# EAGLE design User Input Panel (EAGLE 7.2.0)
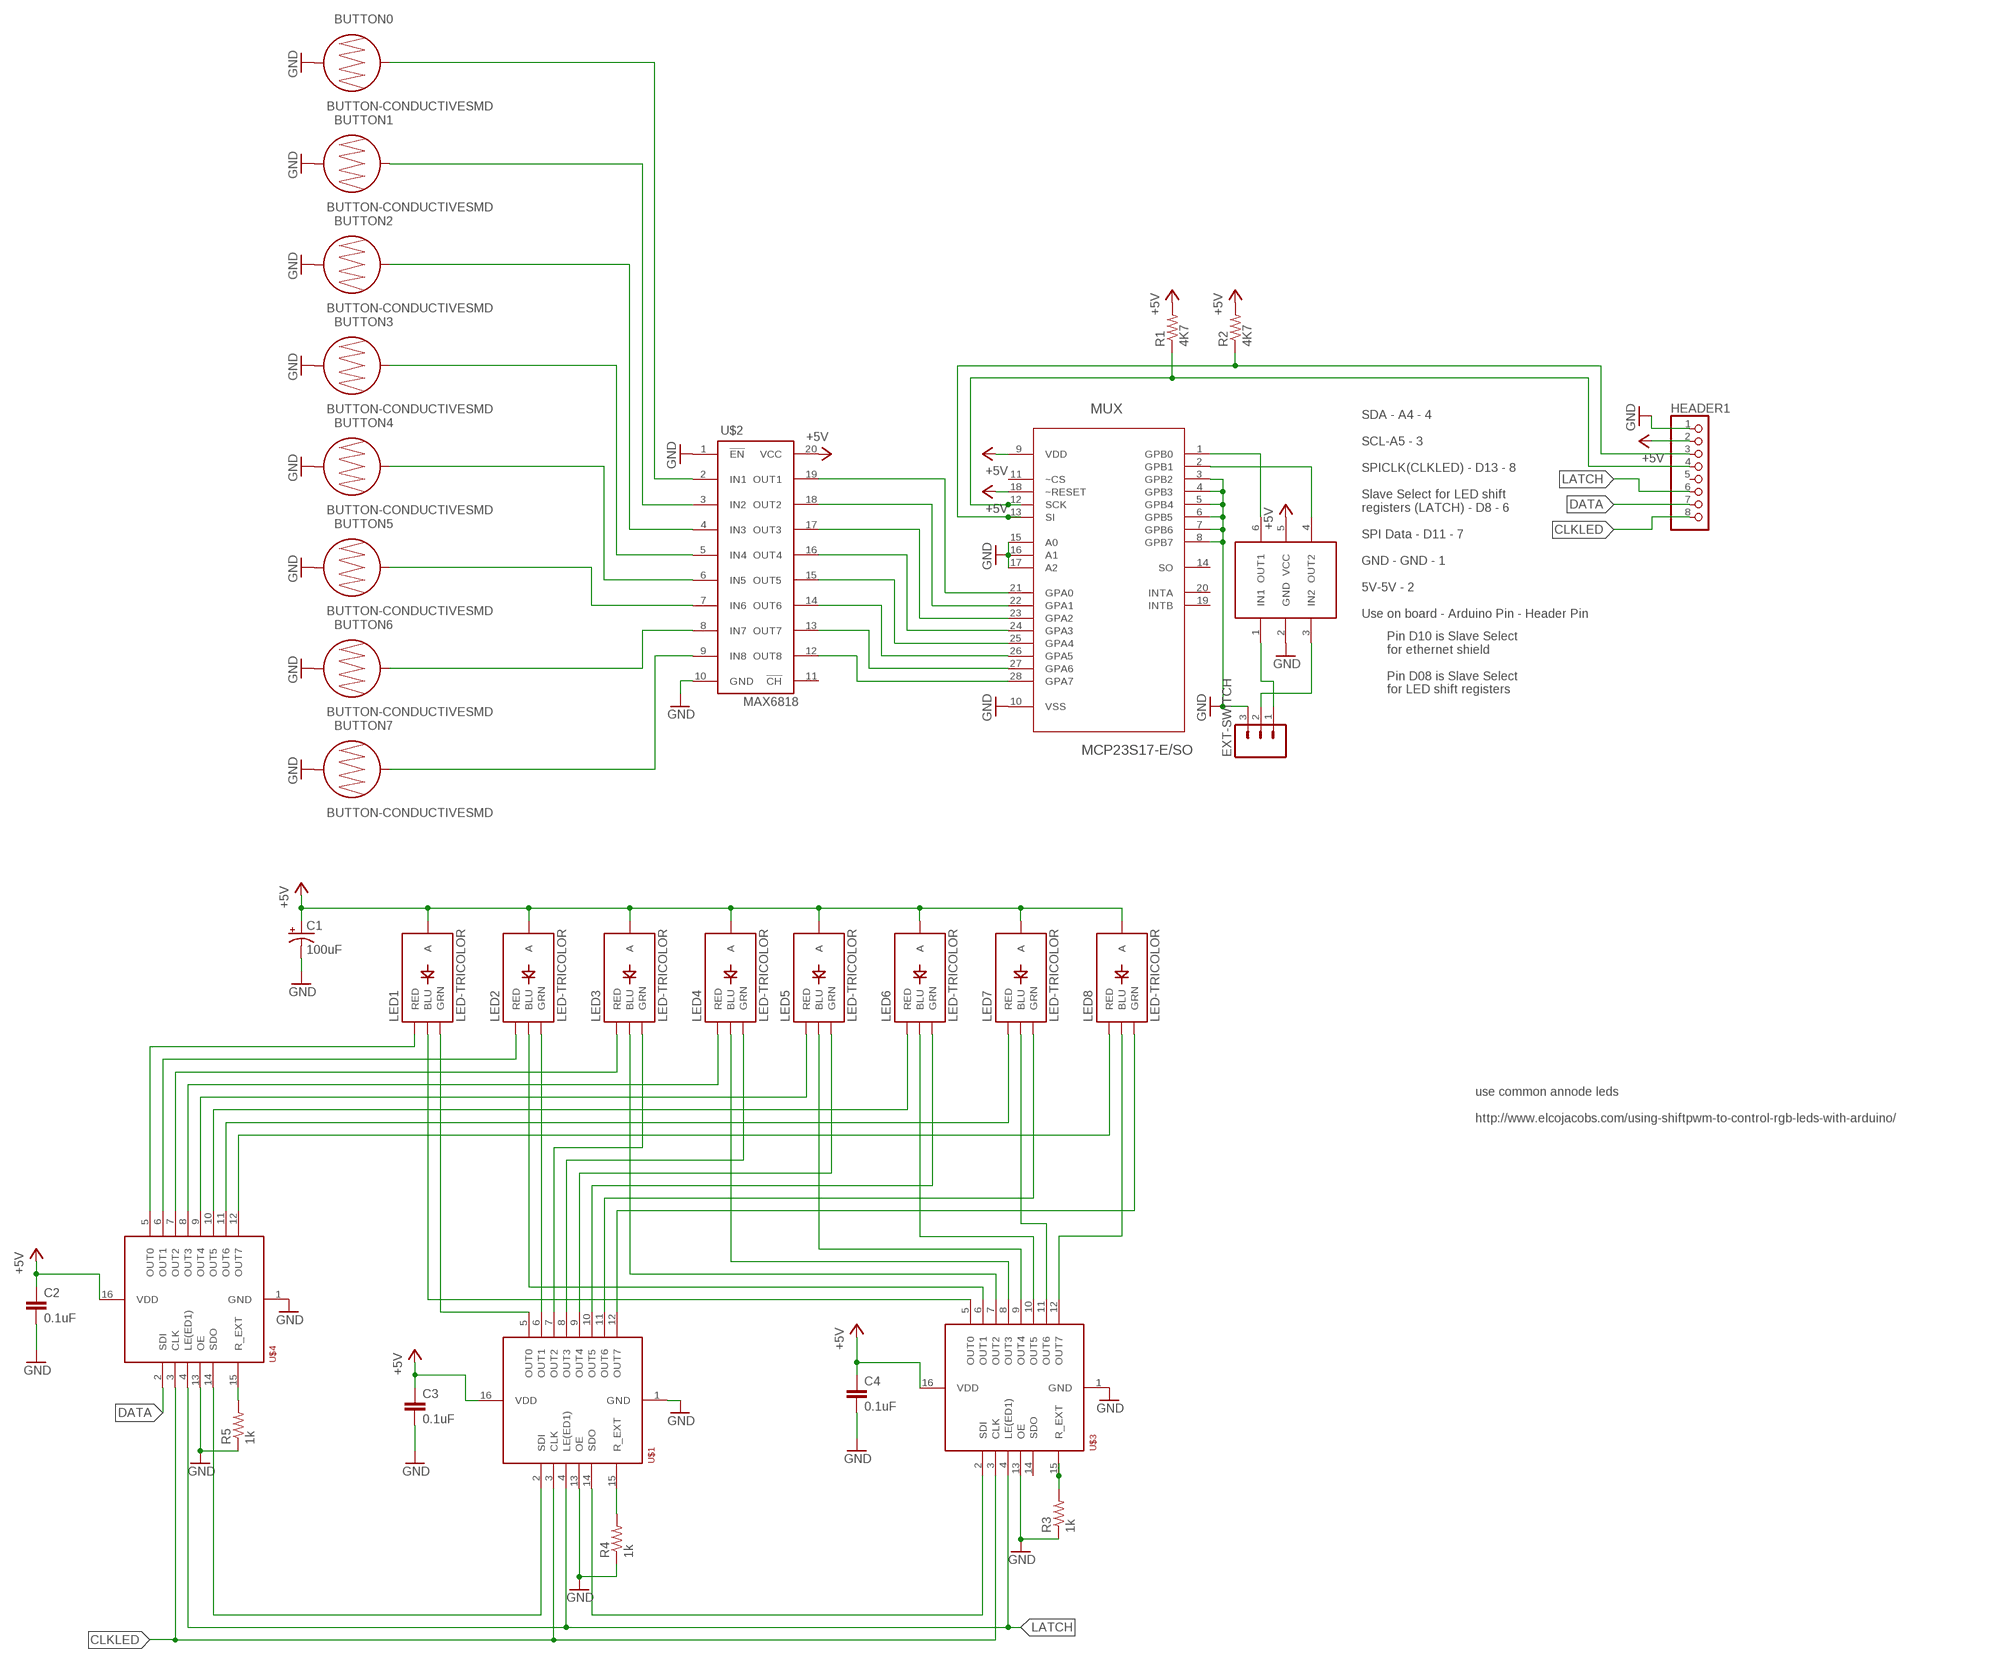
[diagram p0: schematic, sheet 1]

## Parts
BUTTON0  BUTTON-CONDUCTIVESMD  [BUTTON-CONDUCTIVE]
BUTTON1  BUTTON-CONDUCTIVESMD  [BUTTON-CONDUCTIVE]
BUTTON2  BUTTON-CONDUCTIVESMD  [BUTTON-CONDUCTIVE]
BUTTON3  BUTTON-CONDUCTIVESMD  [BUTTON-CONDUCTIVE]
BUTTON4  BUTTON-CONDUCTIVESMD  [BUTTON-CONDUCTIVE]
BUTTON5  BUTTON-CONDUCTIVESMD  [BUTTON-CONDUCTIVE]
BUTTON6  BUTTON-CONDUCTIVESMD  [BUTTON-CONDUCTIVE]
BUTTON7  BUTTON-CONDUCTIVESMD  [BUTTON-CONDUCTIVE]
C1  100uF  CAP_POL1206  [EIA3216]
C2  0.1uF  0.1UF-16V(+-10%)(0402)  [0402-CAP]
C3  0.1uF  0.1UF-16V(+-10%)(0402)  [0402-CAP]
C4  0.1uF  0.1UF-16V(+-10%)(0402)  [0402-CAP]
EXT-SWITCH  M03-SCREW-5MM  [SCREWTERMINAL-5MM-3]
HEADER1  PINHD-1X8BIG  [1X08-BIG]
LED1  LED-TRICOLOR  [LED-TRICOLOR-SMD]
LED2  LED-TRICOLOR  [LED-TRICOLOR-SMD]
LED3  LED-TRICOLOR  [LED-TRICOLOR-SMD]
LED4  LED-TRICOLOR  [LED-TRICOLOR-SMD]
LED5  LED-TRICOLOR  [LED-TRICOLOR-SMD]
LED6  LED-TRICOLOR  [LED-TRICOLOR-SMD]
LED7  LED-TRICOLOR  [LED-TRICOLOR-SMD]
LED8  LED-TRICOLOR  [LED-TRICOLOR-SMD]
MUX  MCP23S17-E/SO  [SOIC127P030X265-28N]
R1  4K7  R-US_0204/2V  [0204V]
R2  4K7  R-US_0204/2V  [0204V]
R3  1k  RESISTOR0402  [0402-RES]
R4  1k  RESISTOR0402  [0402-RES]
R5  1k  RESISTOR0402  [0402-RES]
U$1  TLC5916/17  [SOIC-16]
U$2  MAX6818  [SSOP20]
U$3  TLC5916/17  [SOIC-16]
U$4  TLC5916/17  [SOIC-16]
U$5  MAX6817  [SOT23-6L]

## Nets
+5V: C1.A(+) C2.1 C3.1 C4.1 HEADER1.2 LED1.A LED2.A LED3.A LED4.A LED5.A LED6.A LED7.A LED8.A U$1.16(VDD) U$2.20(VCC) U$3.16(VDD) U$4.16(VDD) U$5.5(VCC)
CLKLED: HEADER1.8 U$1.3(CLK) U$3.3(CLK) U$4.3(CLK)
DATA: HEADER1.7 U$4.2(SDI)
GND: BUTTON0.1 BUTTON1.1 BUTTON2.1 BUTTON3.1 BUTTON4.1 BUTTON5.1 BUTTON6.1 BUTTON7.1 C1.C(-) C2.2 C3.2 C4.2 EXT-SWITCH.3 HEADER1.1 MUX.3(GPB2) MUX.4(GPB3) MUX.5(GPB4) MUX.6(GPB5) MUX.7(GPB6) MUX.8(GPB7) MUX.10(VSS) MUX.15(A0) MUX.16(A1) MUX.17(A2) R3.1 R4.1 R5.1 U$1.1(GND) U$1.13(OE) U$2.1(!EN!) U$2.10(GND) U$3.1(GND) U$3.13(OE) U$4.1(GND) U$4.13(OE) U$5.2(GND)
LATCH: HEADER1.6 U$1.4(LE(ED1)) U$3.4(LE(ED1)) U$4.4(LE(ED1))
N$1: MUX.28(GPA7) U$2.12(OUT8)
N$2: MUX.24(GPA3) U$2.16(OUT4)
N$3: MUX.26(GPA5) U$2.14(OUT6)
N$4: MUX.25(GPA4) U$2.15(OUT5)
N$5: MUX.27(GPA6) U$2.13(OUT7)
N$6: MUX.23(GPA2) U$2.17(OUT3)
N$7: MUX.22(GPA1) U$2.18(OUT2)
N$8: MUX.21(GPA0) U$2.19(OUT1)
N$9: HEADER1.4 MUX.12(SCK) R1.1
N$10: HEADER1.3 MUX.13(SI) R2.1
N$13: U$1.2(SDI) U$4.14(SDO)
N$14: U$1.14(SDO) U$3.2(SDI)
N$15: MUX.1(GPB0) U$5.6(OUT1)
N$16: R5.2 U$4.15(R_EXT)
N$17: LED5.R(RED) U$4.9(OUT4)
N$18: LED6.R(RED) U$4.10(OUT5)
N$19: LED7.R(RED) U$4.11(OUT6)
N$20: R4.2 U$1.15(R_EXT)
N$21: R3.2 U$3.15(R_EXT)
N$22: LED1.R(RED) U$4.5(OUT0)
N$23: LED2.R(RED) U$4.6(OUT1)
N$24: LED3.R(RED) U$4.7(OUT2)
N$25: LED4.R(RED) U$4.8(OUT3)
N$26: LED8.R(RED) U$4.12(OUT7)
N$27: LED1.G(GRN) U$1.5(OUT0)
N$28: LED2.G(GRN) U$1.6(OUT1)
N$29: LED3.G(GRN) U$1.7(OUT2)
N$30: LED4.G(GRN) U$1.8(OUT3)
N$31: LED5.G(GRN) U$1.9(OUT4)
N$32: LED6.G(GRN) U$1.10(OUT5)
N$33: LED7.G(GRN) U$1.11(OUT6)
N$34: LED8.G(GRN) U$1.12(OUT7)
N$35: LED2.B(BLU) U$3.6(OUT1)
N$36: LED1.B(BLU) U$3.5(OUT0)
N$37: LED3.B(BLU) U$3.7(OUT2)
N$38: LED4.B(BLU) U$3.8(OUT3)
N$39: LED5.B(BLU) U$3.9(OUT4)
N$40: LED6.B(BLU) U$3.10(OUT5)
N$41: LED7.B(BLU) U$3.11(OUT6)
N$42: LED8.B(BLU) U$3.12(OUT7)
N$45: MUX.2(GPB1) U$5.4(OUT2)
N$46: BUTTON0.2 U$2.2(IN1)
N$47: BUTTON1.2 U$2.3(IN2)
N$48: BUTTON2.2 U$2.4(IN3)
N$49: BUTTON3.2 U$2.5(IN4)
N$52: BUTTON4.2 U$2.6(IN5)
N$53: BUTTON5.2 U$2.7(IN6)
N$54: BUTTON7.2 U$2.9(IN8)
N$55: BUTTON6.2 U$2.8(IN7)
N$56: EXT-SWITCH.1 U$5.1(IN1)
N$57: EXT-SWITCH.2 U$5.3(IN2)
VCC: MUX.9(VDD) MUX.18(~RESET) R1.2 R2.2 ; supply symbol labelled +5V
Unconnected: HEADER1.5 MUX.11(~CS) MUX.14(SO) MUX.19(INTB) MUX.20(INTA) U$2.11(!CH!) U$3.14(SDO)

## Notes on the sheet
- SDA - A4 - 4
  
  SCL-A5 - 3
  
  SPICLK(CLKLED) - D13 - 8
  
  Slave Select for LED shift
  registers (LATCH) - D8 - 6
  
  SPI Data - D11 - 7
  
  GND - GND - 1
  
  5V-5V - 2
  
  Use on board - Arduino Pin - Header Pin
- Pin D10 is Slave Select
  for ethernet shield
  
  Pin D08 is Slave Select
  for LED shift registers
- use common annode leds
  
  http://www.elcojacobs.com/using-shiftpwm-to-control-rgb-leds-with-arduino/

## Library data of the parts
BUTTON0 BUTTON1-BUTTON7 = SparkFun-Electromechanical:BUTTON-CONDUCTIVE: Used with rubber key pads. This one was designed and proven to work with the PolyCase Key FOB enclosures.
C1 = SparkFun-Capacitors:CAP_POL: Capacitor Polarized These are standard SMD and PTH capacitors. Normally 10uF, 47uF, and 100uF in electrolytic and tantalum varieties. Always verify the external diameter of the through hole cap, it varies with capacity, voltage, and manufacturer. The EIA devices should be standard.
C2-C4 = SparkFun-Capacitors:0.1UF-16V(+-10%)(0402); PROD_ID: CAP-12416
EXT-SWITCH = SparkFun-Connectors:M03: Header 3 Standard 3-pin 0.1" header. Use with straight break away headers (SKU : PRT-00116), right angle break away headers (PRT-00553), swiss pins (PRT-00743), machine pins (PRT-00117), and female headers (PRT-00115). Molex polarized connector foot print use with SKU : PRT-08232 with associated crimp pins and housings.; STOREFRONT_ID: PRT-08433
HEADER1 = adafruit:PINHD-1X8: PIN HEADER
LED1-LED8 = SparkFun-LED:LED-TRICOLOR: Tri-Color LED SMD Proven layout and schematic for triple color LED in SMD package - common anode. Spark Fun Electronics SKU : COM-07844
MUX = Microchip_By_element14_Batch_1:MCP23S17-E/SO: 16-Bit I/O Expander; DESCRIPTION: IC I/O EXPANDER; MPN: MCP23S17-E/SO; OC_FARNELL: 1332093; OC_NEWARK: 31K2950; PACKAGE: SOIC-28; SUPPLIER: Microchip
R1 R2 = resistor:R-US_: RESISTOR, American symbol
R3-R5 = SparkFun-Resistors:RESISTOR: Resistor Basic schematic elements and footprints for 0603, 1206, and PTH resistors.
U$1 U$3 U$4 = BillPorter:TLC5916/17: TLC5916/17 8-Channel Constant-Current LED Sink Driver and Shift Register in one. Great for driving high current LEDs that would kill a 595 shift register. Specs @ http://focus.ti.com/docs/prod/folders/print/tlc5916.html
U$2 = MAX68xx Hardware Debouncer:MAX6818
U$5 = MAX68xx Hardware Debouncer:MAX6817

## Board
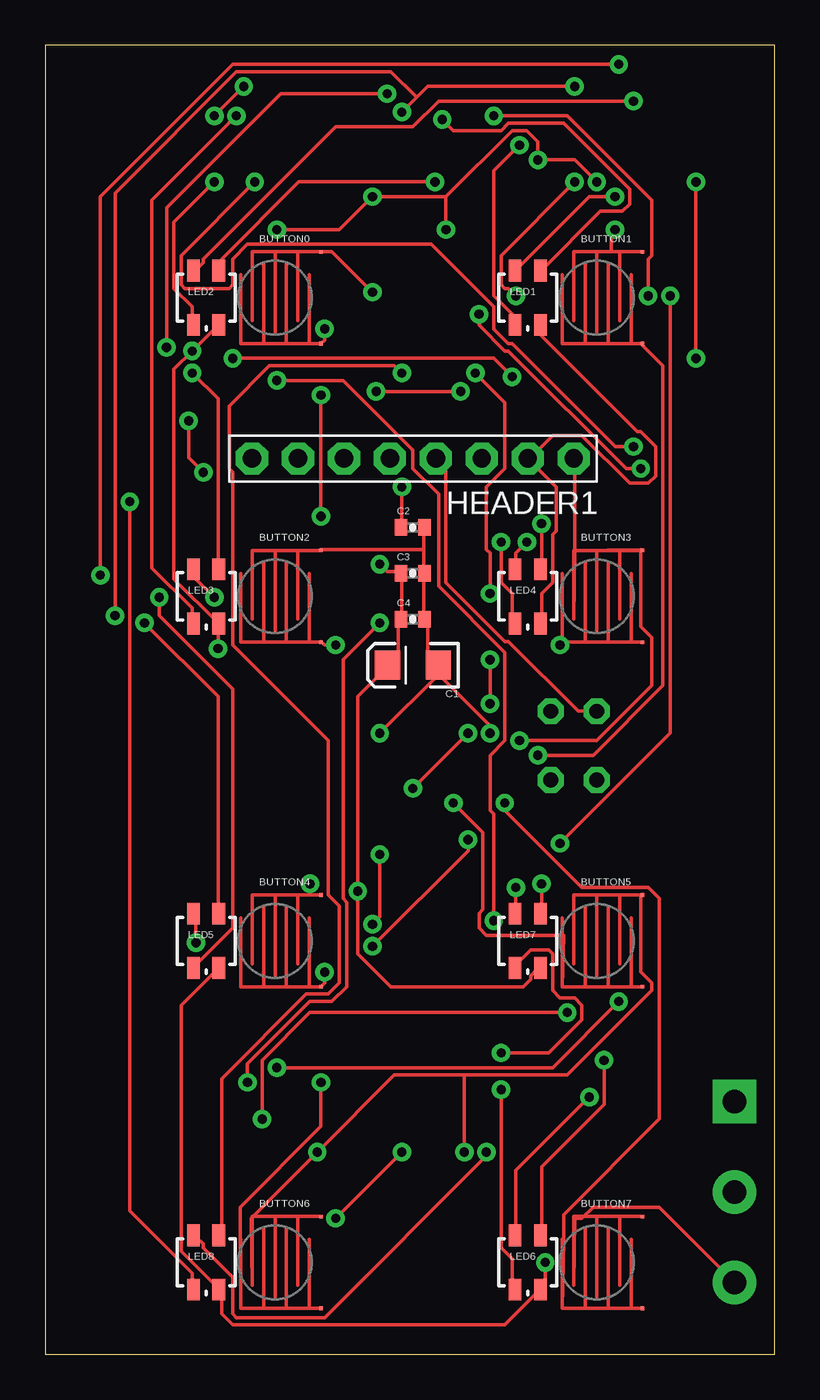
[diagram p1: board, top side]
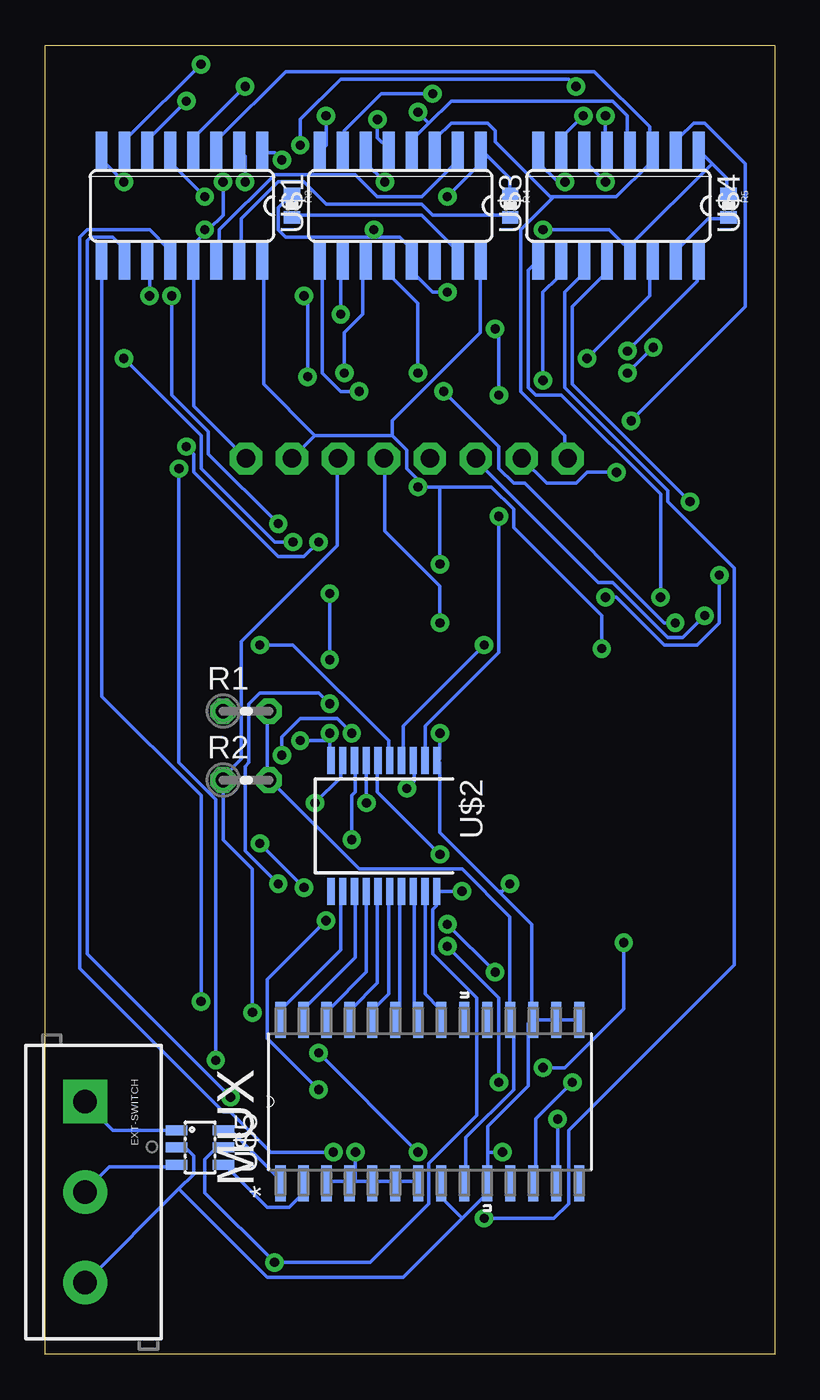
[diagram p2: board, bottom side, seen from below]

Size 40.31 x 72.38 mm. Coordinates in mm from the lower left corner, seen from the top.
Outline: 0,0 40.31,0 40.31,72.38 0,72.38 0,0
Copper layers (1*16): Top 0.035mm / dielectric 1.5mm / Bottom 0.035mm
Design rules "SparkFun": minimum track width 8mil, minimum drill 20mil, track to track 8mil, track to pad 8mil, pad to pad 8mil, via to via 8mil, smd to smd 8mil, copper to edge 10mil, drill to drill 8mil, minimum pad ring 12mil, minimum via ring 10mil, stop-mask expansion 4mil, vias tented up to drill 25mil, thermal gap 10mil

### Footprints (pad centres in the part's own frame; a part is rotated, then mirrored left to right if it is on the bottom)
BUTTON-CONDUCTIVE = smd 0.203 x 0.203: 1 2.54,2.54; 2 2.54,-2.54
EIA3216 = smd 1.4 x 1.6: A 1.4,0; C -1.4,0
0402-CAP = smd 0.7 x 0.9: 1 -0.65,0; 2 0.65,0
SCREWTERMINAL-5MM-3 = drill 1.3 pad 2.413 square: 1 0,0 | drill 1.3 pad 2.413: 2 5,0; 3 10,0
1X08-BIG = drill 1.016 pad 1.778 octagon: 1 -8.89,0; 2 -6.35,0; 3 -3.81,0; 4 -1.27,0; 5 1.27,0; 6 3.81,0; 7 6.35,0; 8 8.89,0
LED-TRICOLOR-SMD = smd 0.7 x 1.2: A 0.7,-1.5; B 0.7,1.5; G -0.7,1.5; R -0.7,-1.5
SOIC127P030X265-28N = smd 1.981 x 0.559: 1 -4.521,8.255; 2 -4.521,6.985; 3 -4.521,5.715; 4 -4.521,4.445; 5 -4.521,3.175; 6 -4.521,1.905; 7 -4.521,0.635; 8 -4.521,-0.635; 9 -4.521,-1.905; 10 -4.521,-3.175; 11 -4.521,-4.445; 12 -4.521,-5.715; 13 -4.521,-6.985; 14 -4.521,-8.255; 15 4.521,-8.255; 16 4.521,-6.985; 17 4.521,-5.715; 18 4.521,-4.445; 19 4.521,-3.175; 20 4.521,-1.905; 21 4.521,-0.635; 22 4.521,0.635; 23 4.521,1.905; 24 4.521,3.175; 25 4.521,4.445; 26 4.521,5.715; 27 4.521,6.985; 28 4.521,8.255
0204V = drill 0.813 octagon: 1 -1.27,0; 2 1.27,0
0402-RES = smd 0.7 x 0.9: 1 -0.65,0; 2 0.65,0
SOIC-16 = smd 0.66 x 2.032: 1 -4.075,-3.073; 2 -2.805,-3.073; 3 -1.535,-3.073; 4 -0.265,-3.073; 5 1.005,-3.073; 6 2.275,-3.073; 7 3.545,-3.073; 8 4.815,-3.073; 9 4.815,3.073; 10 3.545,3.073; 11 2.275,3.073; 12 1.005,3.073; 13 -0.265,3.073; 14 -1.535,3.073; 15 -2.805,3.073; 16 -4.075,3.073
SSOP20 = smd 0.4 x 1.5: 1 -2.925,-3.625; 2 -2.275,-3.625; 3 -1.625,-3.625; 4 -0.975,-3.625; 5 -0.325,-3.625; 6 0.325,-3.625; 7 0.975,-3.625; 8 1.625,-3.625; 9 2.275,-3.625; 10 2.925,-3.625; 11 2.925,3.625; 12 2.275,3.625; 13 1.625,3.625; 14 0.975,3.625; 15 0.325,3.625; 16 -0.325,3.625; 17 -0.975,3.625; 18 -1.625,3.625; 19 -2.275,3.625; 20 -2.925,3.625
SOT23-6L = smd 0.55 x 1.2: 1 -0.95,-1.3; 2 0,-1.3; 3 0.95,-1.3; 4 0.95,1.3; 5 0,1.3; 6 -0.95,1.3

### Placement (x,y rotation side)
BUTTON0  12.7,58.42 0 top
BUTTON1  30.48,58.42 0 top
BUTTON2  12.7,41.91 0 top
BUTTON3  30.48,41.91 0 top
BUTTON4  12.7,22.86 0 top
BUTTON5  30.48,22.86 0 top
BUTTON6  12.7,5.08 0 top
BUTTON7  30.48,5.08 0 top
C1  20.32,38.1 180 top
C2  20.32,45.72 0 top
C3  20.32,43.18 0 top
C4  20.32,40.64 0 top
EXT-SWITCH  38.1,13.97 270 bottom
HEADER1  20.32,49.53 180 top
LED1  26.67,58.42 0 top
LED2  8.89,58.42 0 top
LED3  8.89,41.91 0 top
LED4  26.67,41.91 0 top
LED5  8.89,22.86 0 top
LED6  26.67,5.08 0 top
LED7  26.67,22.86 0 top
LED8  8.89,5.08 0 top
MUX  19.05,13.97 90 bottom
R1  29.21,35.56 0 bottom
R2  29.21,31.75 0 bottom
R3  26.67,63.5 270 bottom
R4  14.61,63.5 270 bottom
R5  2.54,63.5 270 bottom
U$1  32.38,63.5 180 bottom
U$2  21.59,29.21 180 bottom
U$3  20.32,63.5 180 bottom
U$4  8.26,63.5 180 bottom
U$5  31.75,11.43 270 bottom

### Tracks (layer width: path | path; a pad name or v marks a point on that pad's centre or on a via)
+5V  (via drill 0.51)
  Top 0.203: LED5.A 9.55,21.34 7.52,19.3 7.52,5.69 9.55,3.66 LED8.A 9.75,3.45 9.75,2.23 10.36,1.63 25.4,1.63 27.23,3.45 LED6.A 27.43,3.66 27.64,3.86 v27.64,5.08 | LED7.A 27.23,21.34 26.82,20.93 26.82,20.73 26.42,20.32 19.1,20.32 17.27,22.15 v17.27,25.6 17.27,36.37 18.9,38 C1.A 19.1,38.2 19.51,38.61 19.51,40.64 C4.1 19.71,40.64 19.71,43.08 C3.1 19.51,43.28 18.9,43.28 v18.49,43.69 | LED2.A 9.55,56.9 v8.13,55.47 7.11,54.46 7.11,42.88 9.55,40.44 LED3.A 9.55,40.23 v9.55,39.01 | v19.71,47.95 19.71,45.72 C2.1 | LED4.A 27.43,40.44 27.43,42.06 28.04,42.67 28.04,45.31 28.25,45.52 28.25,47.95 HEADER1.2 26.82,49.58 28.04,50.8 29.67,50.8 32.31,48.16 33.33,48.16 33.73,48.56 33.73,50.19 32.92,51 32.72,51 27.43,56.29 27.43,56.9 LED1.A
  Bottom 0.203: U$5.5 30.48,11.38 30.89,11.38 31.5,10.77 31.5,8.94 v27.64,5.08 22.35,5.08 19.1,8.33 19.1,10.57 16.46,13.21 16.46,19.71 18.9,22.15 18.9,24.59 18.69,24.79 18.69,25.4 U$2.20 18.49,25.6 v17.27,25.6 | v8.13,55.47 4.27,59.33 4.27,60.35 U$4.16 | 21.13,50.8 20.32,49.99 20.32,48.97 19.71,48.36 v19.71,47.95 18.49,47.95 | 25.4,50.8 21.13,50.8 | HEADER1.2 25.4,50.8 | 21.13,50.8 21.13,51.61 16.26,56.49 16.26,60.35 U$3.16 | 25.4,50.8 28.25,53.65 28.25,60.35 U$1.16 | v9.55,39.01 9.55,40.84 14.43,45.72 14.43,46.74 15.65,47.95 18.49,47.95 | 18.49,47.95 v18.49,43.69
CLKLED
  Bottom 0.203: 12.19,64.01 12.39,64.01 15.44,67.06 15.44,67.67 15.85,68.07 17.88,68.07 18.69,67.26 18.69,66.65 U$3.3 | 12.19,64.01 8.74,64.01 6.91,65.84 6.91,66.45 U$4.3 6.91,66.65 6.91,67.87 9.96,70.92 27.03,70.92 30.68,67.26 30.68,66.65 U$1.3 | 12.19,64.01 14.02,62.18 14.02,53.24 11.58,50.8 11.58,49.58 HEADER1.8
DATA  (via drill 0.51)
  Top 0.203: v7.92,51.61 7.92,49.58 v8.74,48.77
  Bottom 0.203: v7.92,51.61 1.63,57.91 1.63,65.84 3.86,68.07 4.47,68.07 5.28,67.26 5.28,66.65 U$4.2 | v8.74,48.77 10.36,48.77 10.97,48.16 12.6,48.16 HEADER1.7
GND  (via drill 0.51)
  Top 0.203: BUTTON0.1 15.85,60.96 v18.09,58.73 | v30.48,64.82 29.26,66.04 v27.23,66.04 27.23,67.06 26.62,67.67 25.81,67.67 22.15,64.01 | 29.21,40.64 29.26,44.5 29.26,49.38 HEADER1.1 | v31.5,62.18 31.29,61.98 31.29,60.96 29.21,60.96 | 22.15,64.01 v18.09,64.01 16.26,62.18 v12.8,62.18 | 22.15,64.01 v22.15,62.18 | 20.93,44.5 20.93,43.28 C3.2 20.93,43.08 20.93,40.64 C4.2 21.13,40.64 21.13,38.61 21.54,38.2 C1.C | 20.93,44.5 20.93,45.72 C2.2 | v24.59,34.34 24.59,34.75 21.74,37.59 | 21.74,37.59 21.74,38 C1.C | 20.93,44.5 15.24,44.5 BUTTON2.1 | 29.21,3.81 29.26,7.52 29.67,7.52 30.28,8.13 33.93,8.13 38,4.06 EXT-SWITCH.3 | 11.43,3.81 11.38,7.52 v15.04,11.18 19.3,15.44 23.16,15.44 | v14.63,26.01 14.63,25.4 11.43,25.4 | 23.16,15.44 28.85,15.44 33.53,20.12 33.53,20.52 32.92,21.13 32.92,25.4 29.21,25.4 | v18.49,34.34 21.74,37.59 | 21.74,37.59 C1.C | v26.21,33.93 30.48,33.93 33.53,36.98 33.53,39.62 32.92,40.23 32.92,44.5 29.21,44.45 | v23.16,11.18 23.16,15.44
  Bottom 0.203: 22.15,61.77 20.73,61.77 20.12,61.16 20.12,60.55 U$3.13 19.91,60.35 19.91,59.74 18.9,58.73 v18.09,58.73 | 22.15,61.77 27.03,61.77 27.43,62.18 27.43,63.4 26.82,64.01 R3.1 | 3.45,65.84 4.06,66.45 U$4.1 | 3.45,65.84 2.64,65.02 2.64,64.21 R5.1 | 7.92,61.37 7.92,60.55 U$4.13 7.92,61.37 | 3.45,65.84 7.92,61.37 | 15.85,66.24 16.05,66.45 U$3.1 | 15.85,66.24 14.63,65.02 14.63,64.21 R4.1 | HEADER1.1 32.11,52.43 32.11,60.35 U$1.13 32.11,60.55 32.11,61.37 31.29,62.18 | v27.23,66.04 27.64,66.45 28.25,66.45 U$1.1 | v30.48,64.82 30.48,62.99 31.29,62.18 | 31.29,62.18 v31.5,62.18 | v18.09,64.01 15.85,66.24 | 7.92,61.37 8.33,61.37 9.14,62.18 v12.8,62.18 | v22.15,62.18 22.15,61.77 | 24.59,33.93 24.59,32.92 U$2.10 | 32.92,9.14 38,4.06 EXT-SWITCH.3 | 32.92,9.14 32.11,9.96 32.11,10.97 32.51,11.38 32.92,11.38 U$5.2 | MUX.15 MUX.16 MUX.17 13.41,18.49 | 15.24,25.6 13.41,23.77 13.41,18.49 | 15.24,25.6 18.49,28.85 18.49,32.72 U$2.1 18.49,32.92 v18.49,34.34 | 15.85,11.18 15.85,12.6 13.61,14.83 13.61,18.29 13.41,18.49 | 15.85,11.18 15.85,9.55 MUX.10 16.05,9.35 16.05,8.74 17.27,7.52 | 15.85,11.18 v15.04,11.18 | v14.63,26.01 15.04,25.6 15.24,25.6 | 32.92,9.14 28.04,4.27 20.52,4.27 17.27,7.52 | 24.59,33.93 v26.21,33.93 | 24.59,33.93 v24.59,34.34 | MUX.7 19.71,9.55 20.93,9.55 MUX.6 21.13,9.55 22.15,9.55 MUX.5 22.35,9.55 23.16,9.55 | 17.27,7.52 18.29,8.53 18.29,9.35 MUX.8 | 23.16,9.55 23.37,9.55 MUX.4 23.57,9.55 24.59,9.55 MUX.3 | 23.16,9.55 v23.16,11.18
LATCH  (via drill 0.51)
  Top 0.203: v29.26,70.1 21.13,70.1 20.52,69.49 | v19.71,68.68 20.52,69.49 | v3.86,40.84 3.86,64.21 10.57,70.92 19.1,70.92 20.52,69.49
  Bottom 0.203: 19.1,68.07 19.91,67.26 19.91,66.65 U$3.4 | 19.1,68.07 17.88,69.29 8.94,69.29 8.13,68.48 8.13,66.65 U$4.4 | v29.26,70.1 32.11,67.26 32.11,66.65 U$1.4 | 19.1,68.07 v19.71,68.68 | v3.86,40.84 5.08,39.62 5.89,39.62 8.94,42.67 9.75,42.67 16.46,49.38 HEADER1.6
N$1
  Bottom 0.203: U$2.12 23.98,25.4 23.98,22.35 27.23,19.1 27.23,18.49 MUX.28
N$2
  Bottom 0.203: U$2.16 21.34,25.4 21.34,19.91 22.15,19.1 22.15,18.49 MUX.24
N$3
  Bottom 0.203: U$2.14 22.55,25.4 22.55,21.13 24.59,19.1 24.59,18.49 MUX.26
N$4
  Bottom 0.203: U$2.15 21.95,25.4 21.95,20.52 23.37,19.1 23.37,18.49 MUX.25
N$5
  Bottom 0.203: U$2.13 23.16,25.4 23.16,21.95 26.01,19.1 26.01,18.49 MUX.27
N$6
  Bottom 0.203: U$2.17 20.73,25.4 20.73,18.69 20.93,18.49 MUX.23
N$7
  Bottom 0.203: U$2.18 19.91,25.4 19.91,18.69 19.71,18.49 MUX.22
N$8
  Bottom 0.203: U$2.19 19.3,25.4 19.3,19.91 18.49,19.1 18.49,18.49 MUX.21
N$9  (via drill 0.51)
  Top 0.203: v11.18,15.04 11.18,16.05 14.63,19.51 15.85,19.51 16.66,20.32 16.66,24.99 16.46,25.2 16.46,38.41 v18.49,40.44 | R1.1 29.46,35.56 25.6,39.42 25.4,39.42 22.15,42.67 22.15,48.97 HEADER1.4
  Bottom 0.203: v11.18,15.04 13.21,13.01 13.21,9.55 MUX.12 | v18.49,40.44 18.49,42.47 21.54,45.52 21.54,49.38 HEADER1.4
N$10  (via drill 0.51)
  Top 0.203: v11.99,13.01 11.99,16.26 14.63,18.9 v28.85,18.9
  Bottom 0.203: v11.99,13.01 11.99,9.55 MUX.13 | v28.85,18.9 28.85,26.82 30.48,28.45 R2.1 30.48,31.9 29.46,32.92 29.46,39.42 24.18,44.7 24.18,49.38 HEADER1.3
N$13  (via drill 0.51)
  Top 0.203: v10.36,55.07 24.79,55.07 v25.81,54.05 | v26.01,58.52 25.6,58.93 25.4,58.93 25.2,59.13 25.2,60.76 v29.26,64.82
  Bottom 0.203: v10.36,55.07 6.91,58.52 6.91,60.35 U$4.14 | v25.81,54.05 25.81,58.32 v26.01,58.52 | v29.26,64.82 29.26,66.24 29.46,66.45 U$1.2
N$14
  Bottom 0.203: U$1.14 30.68,60.55 30.68,62.18 27.64,65.23 23.16,65.23 21.95,64.01 19.51,64.01 17.68,65.84 17.68,66.45 U$3.2
N$15
  Bottom 0.203: U$5.6 30.28,12.19 29.87,12.19 27.23,9.55 MUX.1
N$16
  Bottom 0.203: R5.2 2.64,62.79 3.66,62.79 5.28,61.16 5.28,60.55 U$4.15
N$17  (via drill 0.51)
  Top 0.203: v6.3,41.86 6.3,40.84 10.36,36.78 10.36,23.57 8.33,21.54 LED5.R
  Bottom 0.203: v6.3,41.86 6.3,47.55 11.79,53.03 13.21,53.03 13.61,53.44 13.61,59.94 13.21,60.35 U$4.9
N$18  (via drill 0.51)
  Top 0.203: v25.2,14.63 25.2,5.89 25.81,5.28 25.81,3.66 LED6.R | v24.79,23.98 24.79,29.87 24.59,30.07 24.59,33.12 25.4,33.93 25.4,38.81 21.74,42.47 21.74,47.55 20.32,48.97 20.32,49.99 16.46,53.85 v12.8,53.85
  Bottom 0.203: v25.2,14.63 28.04,17.48 28.04,20.73 v24.79,23.98 | v12.8,53.85 12.8,58.73 11.99,59.54 11.99,60.35 U$4.10
N$19  (via drill 0.51)
  Top 0.203: v25.2,16.66 27.84,16.66 29.67,18.49 29.67,19.3 29.26,19.71 28.45,19.71 28.04,20.12 28.04,22.15 27.84,22.35 26.82,22.35 26.01,21.54 LED7.R | v16.05,7.52 v19.71,11.18
  Bottom 0.203: v19.71,11.18 v25.2,16.66 | v16.05,7.52 12.19,7.52 11.38,8.33 11.38,12.39 2.23,21.54 2.23,43.48 5.89,47.14 5.89,47.75 11.58,53.44 11.58,58.73 10.57,59.74 10.57,60.35 U$4.11
N$20
  Bottom 0.203: R4.2 14.63,62.99 18.9,62.99 19.51,63.6 24.79,63.6 26.01,64.82 27.43,64.82 29.46,62.79 29.46,60.55 U$1.15
N$21
  Bottom 0.203: R3.2 26.62,62.99 19.51,62.99 17.68,61.16 17.68,60.55 U$3.15
N$22  (via drill 0.51)
  Top 0.203: v26.21,66.85 24.79,65.43 24.79,58.52 25.81,57.51 25.81,57.1 LED1.R | v9.35,68.48 v10.97,70.1
  Bottom 0.203: v26.21,66.85 26.21,68.28 23.98,70.51 11.38,70.51 v10.97,70.1 | v9.35,68.48 9.35,66.65 U$4.5
N$23  (via drill 0.51)
  Top 0.203: v9.35,64.82 7.11,62.59 7.11,58.93 8.13,57.91 8.13,57.1 LED2.R
  Bottom 0.203: v9.35,64.82 10.36,65.84 10.36,66.45 U$4.6
N$24  (via drill 0.51)
  Top 0.203: v10.57,68.48 5.89,63.8 5.89,43.48 8.13,41.25 8.13,40.44 LED3.R
  Bottom 0.203: v10.57,68.48 11.79,67.26 11.79,66.65 U$4.7
N$25  (via drill 0.51)
  Top 0.203: v25.2,44.91 25.2,42.67 25.81,42.06 25.81,40.44 LED4.R | v32.51,50.19 31.5,50.19 25.81,55.88 25.6,55.88 24.79,56.69 24.79,57.91 21.34,61.37 11.18,61.37 10.36,60.55 10.36,59.13 10.16,58.93 7.72,58.93 7.52,59.13 7.52,60.76 v11.58,64.82
  Bottom 0.203: v25.2,44.91 26.01,44.09 27.43,44.09 32.11,48.77 32.11,49.78 v32.51,50.19 | v11.58,64.82 11.99,64.82 13.01,65.84 13.01,66.45 U$4.8
N$26  (via drill 0.51)
  Top 0.203: v4.67,47.14 4.67,7.92 8.13,4.47 8.13,3.66 LED8.R
  Bottom 0.203: v4.67,47.14 11.18,53.65 11.18,57.91 9.35,59.74 9.35,60.35 U$4.12
N$27  (via drill 0.51)
  Top 0.203: v31.5,64.01 30.07,64.01 26.01,59.94 LED1.G
  Bottom 0.203: v31.5,64.01 33.33,65.84 33.33,66.45 U$1.5
N$28  (via drill 0.51)
  Top 0.203: v32.51,69.29 21.74,69.29 20.32,67.87 16.05,67.87 8.74,60.55 8.74,60.35 8.33,59.94 LED2.G
  Bottom 0.203: v32.51,69.29 34.54,67.26 34.54,66.65 U$1.6
N$29  (via drill 0.51)
  Top 0.203: v9.35,41.86 8.33,42.88 8.33,43.28 LED3.G | v3.05,43.08 3.05,64.01 10.36,71.32 v31.7,71.32
  Bottom 0.203: v9.35,41.86 8.74,41.86 6.1,39.22 4.27,39.22 3.05,40.44 v3.05,43.08 | v31.7,71.32 35.76,67.26 35.76,66.65 U$1.7
N$30  (via drill 0.51)
  Top 0.203: v26.62,44.91 26.01,44.3 26.01,43.48 LED4.G | v35.97,64.82 v35.97,55.07
  Bottom 0.203: v26.62,44.91 27.64,44.91 31.7,48.97 31.7,50.8 v35.97,55.07 | v35.97,64.82 37.19,66.04 37.19,66.45 U$1.8
N$31  (via drill 0.51)
  Top 0.203: v8.33,22.76 8.33,24.18 LED5.G | v12.8,15.85 28.04,15.85 v31.7,19.51
  Bottom 0.203: v8.33,22.76 8.33,19.1 11.58,15.85 v12.8,15.85 | v31.7,19.51 31.7,30.89 37.19,36.37 37.19,60.35 U$1.9
N$32  (via drill 0.51)
  Top 0.203: v30.07,14.22 26.01,10.16 26.01,6.71 LED6.G
  Bottom 0.203: v30.07,14.22 38,22.15 38,61.57 37.8,61.77 36.58,61.77 35.97,61.16 35.97,60.55 U$1.10
N$33  (via drill 0.51)
  Top 0.203: v26.01,25.81 26.01,24.38 LED7.G | v28.45,28.25 34.54,34.34 v34.54,58.52
  Bottom 0.203: v28.45,28.25 v26.01,25.81 | v34.54,58.52 34.54,60.35 U$1.11
N$34  (via drill 0.51)
  Top 0.203: v24.38,11.18 24.38,10.97 15.44,2.03 10.57,2.03 10.36,2.23 10.36,4.27 8.74,5.89 8.74,6.1 8.33,6.5 LED8.G
  Bottom 0.203: v24.38,11.18 27.84,11.18 30.07,13.41 30.48,13.41 38.41,21.34 38.41,61.77 38,62.18 34.54,62.18 33.53,61.16 33.53,60.55 U$1.12
N$35  (via drill 0.51)
  Top 0.203: v21.54,64.82 14.02,64.82 9.75,60.55 9.75,59.94 LED2.B
  Bottom 0.203: v21.54,64.82 22.55,65.84 22.55,66.45 U$3.6
N$36  (via drill 0.51)
  Top 0.203: v21.95,68.28 22.55,67.67 25.2,67.67 25.6,68.07 28.65,68.07 32.31,64.41 32.31,63.6 31.9,63.2 30.68,63.2 27.43,59.94 LED1.B
  Bottom 0.203: v21.95,68.28 21.95,67.26 21.34,66.65 U$3.5
N$37  (via drill 0.51)
  Top 0.203: v8.13,54.25 9.55,52.83 9.55,43.48 LED3.B | v6.71,55.68 6.71,63.4 13.01,69.7 v18.9,69.7
  Bottom 0.203: v6.71,55.68 v8.13,54.25 | v18.9,69.7 21.74,69.7 23.77,67.67 23.77,66.65 U$3.7
N$38  (via drill 0.51)
  Top 0.203: v27.43,45.92 27.43,43.48 LED4.B | v33.33,58.52 33.33,60.55 33.53,60.76 33.53,63.8 28.85,68.48 v24.79,68.48
  Bottom 0.203: v27.43,45.92 31.29,49.78 31.29,51 33.33,53.03 v33.33,58.52 | v24.79,68.48 24.79,66.85 24.99,66.65 U$3.8
N$39  (via drill 0.51)
  Top 0.203: v5.49,40.44 9.55,36.37 9.55,24.38 LED5.B | v22.96,53.24 v18.29,53.24
  Bottom 0.203: v5.49,40.44 6.1,40.44 13.82,48.16 14.43,48.16 15.24,48.97 15.24,50.19 v18.29,53.24 | v22.96,53.24 23.98,53.24 24.99,54.25 24.99,60.35 U$3.9
N$40  (via drill 0.51)
  Top 0.203: v30.89,16.26 30.89,13.82 27.43,10.36 27.43,6.71 LED6.B | v32.92,48.97 32.11,48.97 25.6,55.47 25.4,55.47 23.98,56.9 v23.98,57.51
  Bottom 0.203: v30.89,16.26 30.89,30.68 32.92,32.72 v32.92,48.97 | v23.98,57.51 23.98,60.35 U$3.10
N$41  (via drill 0.51)
  Top 0.203: v27.43,26.01 27.43,24.38 LED7.B | v24.59,38.41 v24.59,35.97 | v24.59,42.06 24.59,44.3 24.38,44.5 24.38,47.95 25.4,48.97 25.4,52.63 v23.77,54.25
  Bottom 0.203: v27.43,26.01 29.26,27.84 29.26,32.51 29.06,32.72 29.06,35.97 28.45,36.58 25.2,36.58 v24.59,35.97 | v24.59,42.06 v24.59,38.41 | v23.77,54.25 23.77,56.49 22.76,57.51 22.76,60.35 U$3.11
N$42  (via drill 0.51)
  Top 0.203: v19.71,54.25 19.3,54.66 12.39,54.66 10.16,52.43 10.16,48.97 10.36,48.77 10.36,39.22 15.65,33.93 15.65,25.4 16.26,24.79 16.26,20.52 15.65,19.91 14.43,19.91 9.75,15.24 9.75,6.71 LED8.B
  Bottom 0.203: v19.71,54.25 19.71,58.12 21.13,59.54 21.13,60.35 U$3.12
N$45
  Bottom 0.203: U$5.4 30.28,10.36 28.04,8.13 26.82,8.13 26.21,8.74 26.21,9.35 MUX.2
N$46  (via drill 0.51)
  Top 0.203: v15.24,53.03 v15.24,46.33 | v15.44,56.69 15.44,56.08 BUTTON0.2
  Bottom 0.203: v15.24,46.33 15.24,38.81 19.3,34.75 19.3,32.92 U$2.2 | v15.24,53.03 15.24,56.49 v15.44,56.69
N$47  (via drill 0.51)
  Top 0.203: v23.37,34.34 v20.32,31.29 | v27.23,33.12 30.28,33.12 34.14,36.98 34.14,54.66 32.92,55.88 28.57,55.88
  Bottom 0.203: v20.32,31.29 19.91,31.7 19.91,32.72 U$2.3 | v23.37,34.34 24.18,35.15 26.21,35.15 27.23,34.14 v27.23,33.12
N$48  (via drill 0.51)
  Top 0.203: v16.05,39.22 15.44,39.22 15.24,39.42 BUTTON2.2
  Bottom 0.203: v16.05,39.22 20.52,34.75 20.52,32.92 U$2.4
N$49  (via drill 0.51)
  Top 0.203: v28.45,39.22 28.65,39.42 28.57,39.37
  Bottom 0.203: v28.45,39.22 26.62,39.22 21.34,33.93 21.34,32.92 U$2.5
N$52  (via drill 0.51)
  Top 0.203: v18.49,27.64 18.49,24.18 v18.09,23.77 | v15.44,21.13 15.44,20.52 BUTTON4.2
  Bottom 0.203: v18.49,27.64 21.95,31.09 21.95,32.72 U$2.6 | v15.44,21.13 v18.09,23.77
N$53  (via drill 0.51)
  Top 0.203: v22.55,30.48 24.18,28.85 24.18,24.59 23.98,24.38 23.98,23.57 24.38,23.16 28.65,23.16 28.57,20.32
  Bottom 0.203: v22.55,30.48 22.55,32.72 U$2.7
N$54  (via drill 0.51)
  Top 0.203: v25.4,30.48 25.4,30.07 29.67,25.81 33.33,25.81 33.93,25.2 33.93,13.01 28.65,7.72 28.65,6.3 28.57,2.54
  Bottom 0.203: v25.4,30.48 23.98,31.9 23.98,32.72 U$2.9
N$55  (via drill 0.51)
  Top 0.203: v23.37,28.45 23.37,27.84 v18.09,22.55 | v15.24,15.04 15.24,12.6 10.77,8.13 10.77,6.3 10.79,2.54
  Bottom 0.203: v23.37,28.45 23.37,30.89 23.16,31.09 23.16,32.72 U$2.8 | v18.09,22.55 15.24,19.71 v15.24,15.04
N$56
  Bottom 0.203: U$5.1 33.12,12.39 36.58,12.39 38,13.82 EXT-SWITCH.1
N$57
  Bottom 0.203: U$5.3 33.12,10.36 36.78,10.36 38,9.14 EXT-SWITCH.2
VCC
  Bottom 0.203: R1.2 28.04,35.56 28.04,31.9 R2.2 27.84,31.7 22.96,26.82 17.27,26.82 14.63,24.18 14.63,18.49 MUX.18 14.43,18.49 14.43,14.63 17.07,11.99 17.07,9.55 MUX.9

### Text on the board
Reference: Designed to fit within a metal 1 gang utility box. / 4" H x 2.125" W x 1.875" D